# EAGLE design cd32 (EAGLE 7.7.0)
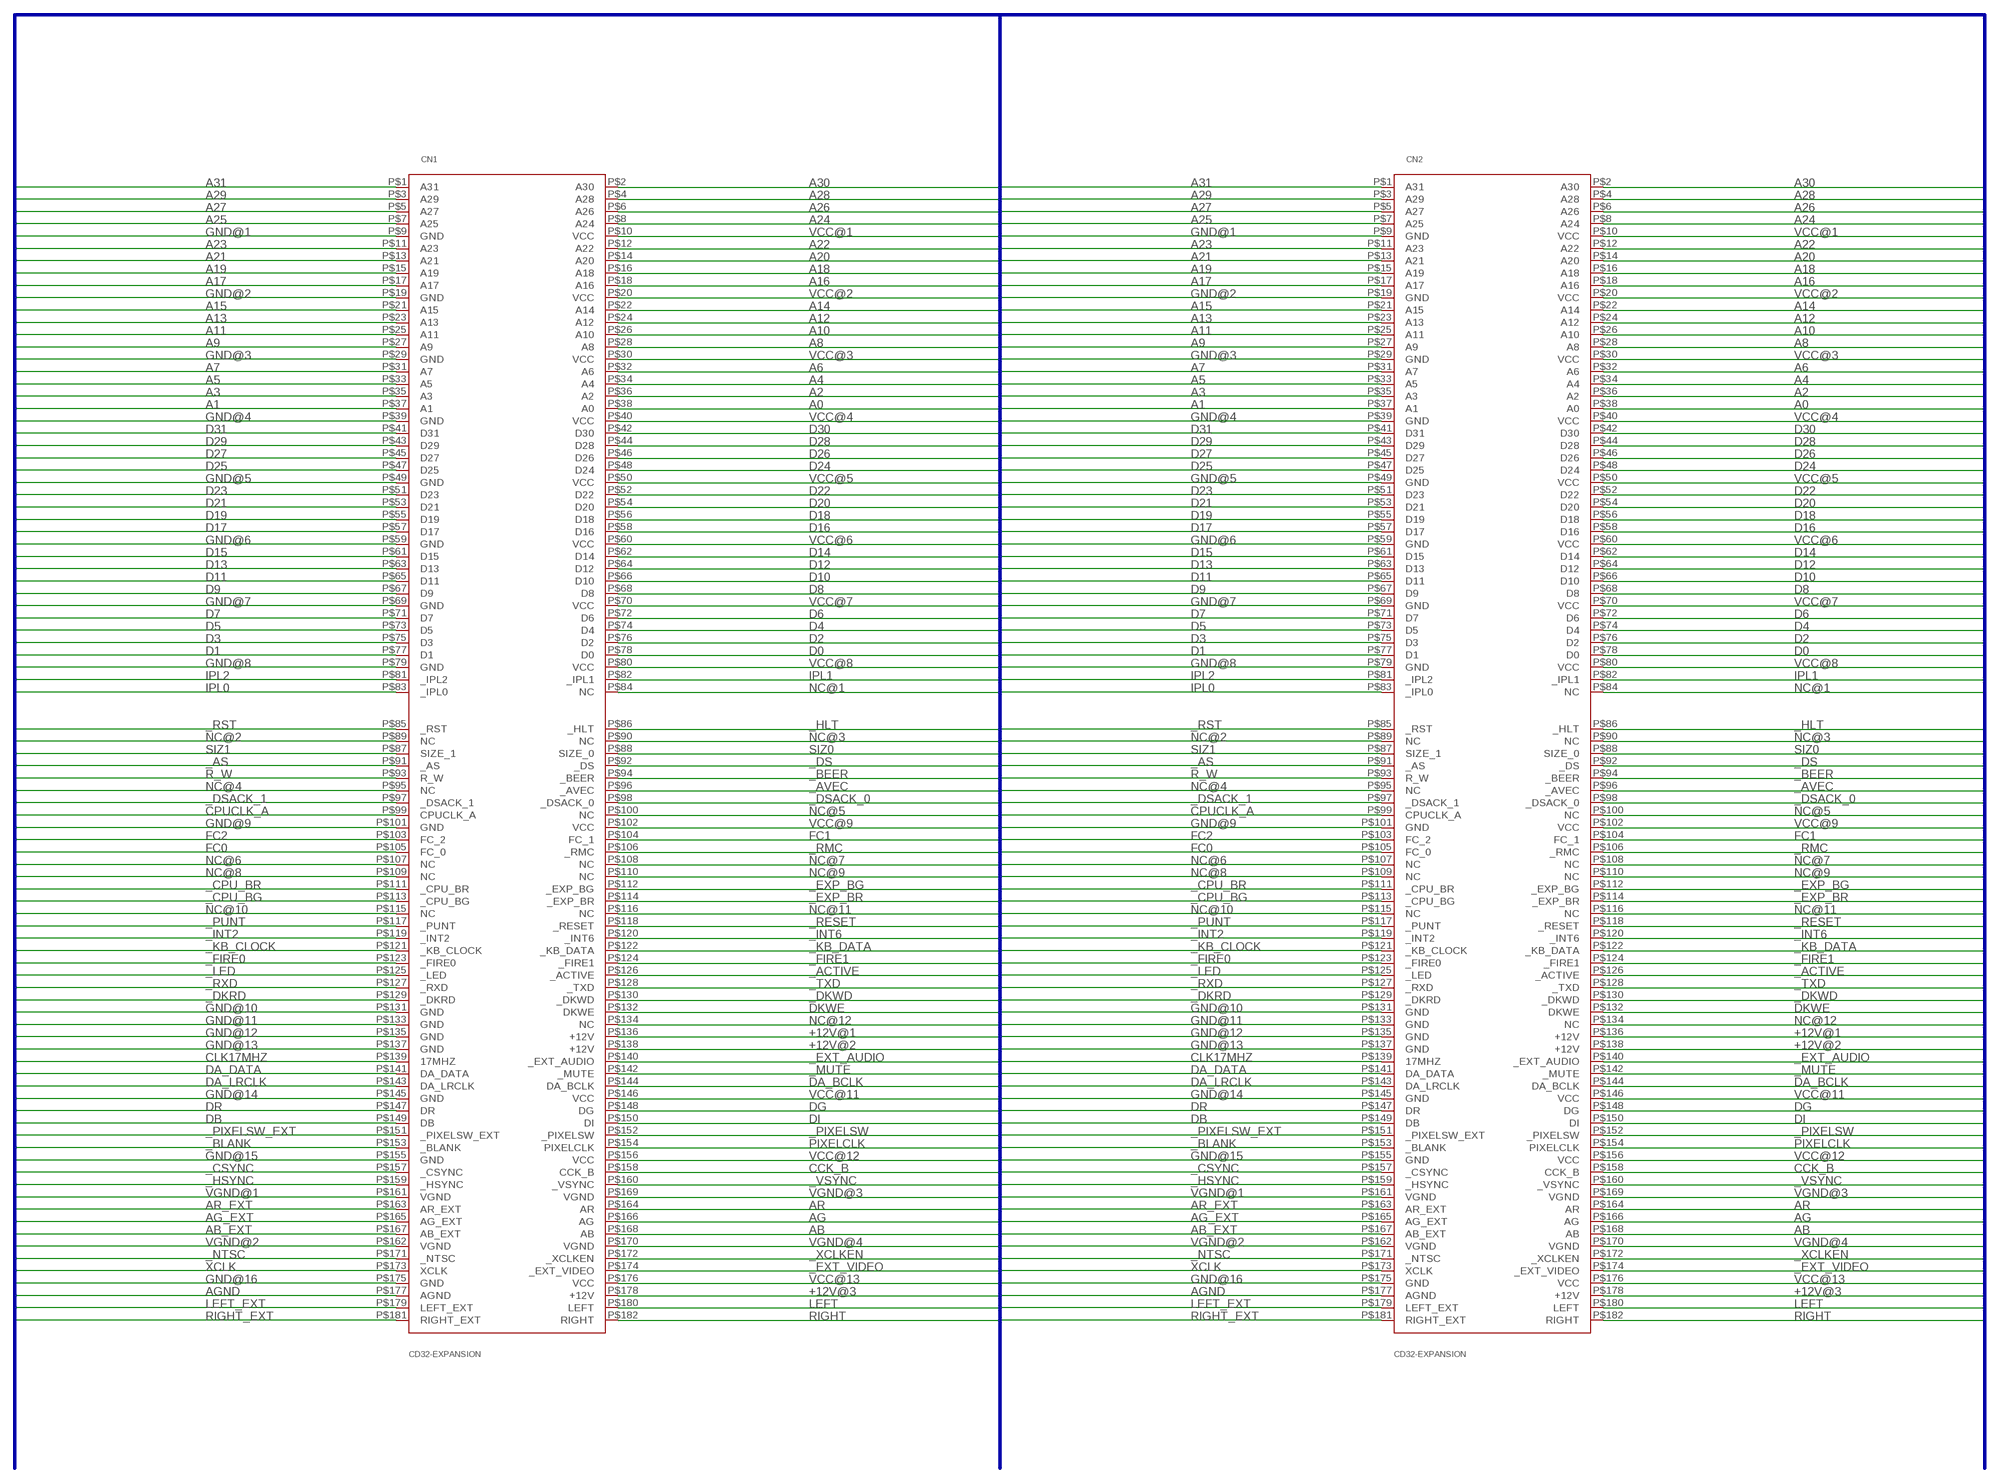
[diagram p0: schematic, sheet 1]

## Parts
CN1  CD32-EXPANSION  [CD32_EXPANSION_182_MCA]
CN2  CD32-EXPANSION  [CD32_EXPANSION_182_MCA]

## Nets
+12V@1: CN1.P$136(+12V) CN2.P$136(+12V)
+12V@2: CN1.P$138(+12V) CN2.P$138(+12V)
+12V@3: CN1.P$178(+12V) CN2.P$178(+12V)
_ACTIVE: CN1.P$126(_ACTIVE) CN2.P$126(_ACTIVE)
_AS: CN1.P$91(_AS) CN2.P$91(_AS)
_AVEC: CN1.P$96(_AVEC) CN2.P$96(_AVEC)
_BEER: CN1.P$94(_BEER) CN2.P$94(_BEER)
_BLANK: CN1.P$153(_BLANK) CN2.P$153(_BLANK)
_CPU_BG: CN1.P$113(_CPU_BG) CN2.P$113(_CPU_BG)
_CPU_BR: CN1.P$111(_CPU_BR) CN2.P$111(_CPU_BR)
_CSYNC: CN1.P$157(_CSYNC) CN2.P$157(_CSYNC)
_DKRD: CN1.P$129(_DKRD) CN2.P$129(_DKRD)
_DKWD: CN1.P$130(_DKWD) CN2.P$130(_DKWD)
_DS: CN1.P$92(_DS) CN2.P$92(_DS)
_DSACK_0: CN1.P$98(_DSACK_0) CN2.P$98(_DSACK_0)
_DSACK_1: CN1.P$97(_DSACK_1) CN2.P$97(_DSACK_1)
_EXP_BG: CN1.P$112(_EXP_BG) CN2.P$112(_EXP_BG)
_EXP_BR: CN1.P$114(_EXP_BR) CN2.P$114(_EXP_BR)
_EXT_AUDIO: CN1.P$140(_EXT_AUDIO) CN2.P$140(_EXT_AUDIO)
_EXT_VIDEO: CN1.P$174(_EXT_VIDEO) CN2.P$174(_EXT_VIDEO)
_FIRE0: CN1.P$123(_FIRE0) CN2.P$123(_FIRE0)
_FIRE1: CN1.P$124(_FIRE1) CN2.P$124(_FIRE1)
_HLT: CN1.P$86(_HLT) CN2.P$86(_HLT)
_HSYNC: CN1.P$159(_HSYNC) CN2.P$159(_HSYNC)
_INT2: CN1.P$119(_INT2) CN2.P$119(_INT2)
_INT6: CN1.P$120(_INT6) CN2.P$120(_INT6)
_KB_CLOCK: CN1.P$121(_KB_CLOCK) CN2.P$121(_KB_CLOCK)
_KB_DATA: CN1.P$122(_KB_DATA) CN2.P$122(_KB_DATA)
_LED: CN1.P$125(_LED) CN2.P$125(_LED)
_MUTE: CN1.P$142(_MUTE) CN2.P$142(_MUTE)
_NTSC: CN1.P$171(_NTSC) CN2.P$171(_NTSC)
_PIXELSW: CN1.P$152(_PIXELSW) CN2.P$152(_PIXELSW)
_PIXELSW_EXT: CN1.P$151(_PIXELSW_EXT) CN2.P$151(_PIXELSW_EXT)
_PUNT: CN1.P$117(_PUNT) CN2.P$117(_PUNT)
_RESET: CN1.P$118(_RESET) CN2.P$118(_RESET)
_RMC: CN1.P$106(_RMC) CN2.P$106(_RMC)
_RST: CN1.P$85(_RST) CN2.P$85(_RST)
_RXD: CN1.P$127(_RXD) CN2.P$127(_RXD)
_TXD: CN1.P$128(_TXD) CN2.P$128(_TXD)
_VSYNC: CN1.P$160(_VSYNC) CN2.P$160(_VSYNC)
_XCLKEN: CN1.P$172(_XCLKEN) CN2.P$172(_XCLKEN)
A0: CN1.P$38(A0) CN2.P$38(A0)
A1: CN1.P$37(A1) CN2.P$37(A1)
A2: CN1.P$36(A2) CN2.P$36(A2)
A3: CN1.P$35(A3) CN2.P$35(A3)
A4: CN1.P$34(A4) CN2.P$34(A4)
A5: CN1.P$33(A5) CN2.P$33(A5)
A6: CN1.P$32(A6) CN2.P$32(A6)
A7: CN1.P$31(A7) CN2.P$31(A7)
A8: CN1.P$28(A8) CN2.P$28(A8)
A9: CN1.P$27(A9) CN2.P$27(A9)
A10: CN1.P$26(A10) CN2.P$26(A10)
A11: CN1.P$25(A11) CN2.P$25(A11)
A12: CN1.P$24(A12) CN2.P$24(A12)
A13: CN1.P$23(A13) CN2.P$23(A13)
A14: CN1.P$22(A14) CN2.P$22(A14)
A15: CN1.P$21(A15) CN2.P$21(A15)
A16: CN1.P$18(A16) CN2.P$18(A16)
A17: CN1.P$17(A17) CN2.P$17(A17)
A18: CN1.P$16(A18) CN2.P$16(A18)
A19: CN1.P$15(A19) CN2.P$15(A19)
A20: CN1.P$14(A20) CN2.P$14(A20)
A21: CN1.P$13(A21) CN2.P$13(A21)
A22: CN1.P$12(A22) CN2.P$12(A22)
A23: CN1.P$11(A23) CN2.P$11(A23)
A24: CN1.P$8(A24) CN2.P$8(A24)
A25: CN1.P$7(A25) CN2.P$7(A25)
A26: CN1.P$6(A26) CN2.P$6(A26)
A27: CN1.P$5(A27) CN2.P$5(A27)
A28: CN1.P$4(A28) CN2.P$4(A28)
A29: CN1.P$3(A29) CN2.P$3(A29)
A30: CN1.P$2(A30) CN2.P$2(A30)
A31: CN1.P$1(A31) CN2.P$1(A31)
AB: CN1.P$168(AB) CN2.P$168(AB)
AB_EXT: CN1.P$167(AB_EXT) CN2.P$167(AB_EXT)
AG: CN1.P$166(AG) CN2.P$166(AG)
AG_EXT: CN1.P$165(AG_EXT) CN2.P$165(AG_EXT)
AGND: CN1.P$177(AGND) CN2.P$177(AGND)
AR: CN1.P$164(AR) CN2.P$164(AR)
AR_EXT: CN1.P$163(AR_EXT) CN2.P$163(AR_EXT)
CCK_B: CN1.P$158(CCK_B) CN2.P$158(CCK_B)
CLK17MHZ: CN1.P$139(17MHZ) CN2.P$139(17MHZ)
CPUCLK_A: CN1.P$99(CPUCLK_A) CN2.P$99(CPUCLK_A)
D0: CN1.P$78(D0) CN2.P$78(D0)
D1: CN1.P$77(D1) CN2.P$77(D1)
D2: CN1.P$76(D2) CN2.P$76(D2)
D3: CN1.P$75(D3) CN2.P$75(D3)
D4: CN1.P$74(D4) CN2.P$74(D4)
D5: CN1.P$73(D5) CN2.P$73(D5)
D6: CN1.P$72(D6) CN2.P$72(D6)
D7: CN1.P$71(D7) CN2.P$71(D7)
D8: CN1.P$68(D8) CN2.P$68(D8)
D9: CN1.P$67(D9) CN2.P$67(D9)
D10: CN1.P$66(D10) CN2.P$66(D10)
D11: CN1.P$65(D11) CN2.P$65(D11)
D12: CN1.P$64(D12) CN2.P$64(D12)
D13: CN1.P$63(D13) CN2.P$63(D13)
D14: CN1.P$62(D14) CN2.P$62(D14)
D15: CN1.P$61(D15) CN2.P$61(D15)
D16: CN1.P$58(D16) CN2.P$58(D16)
D17: CN1.P$57(D17) CN2.P$57(D17)
D18: CN1.P$56(D18) CN2.P$56(D18)
D19: CN1.P$55(D19) CN2.P$55(D19)
D20: CN1.P$54(D20) CN2.P$54(D20)
D21: CN1.P$53(D21) CN2.P$53(D21)
D22: CN1.P$52(D22) CN2.P$52(D22)
D23: CN1.P$51(D23) CN2.P$51(D23)
D24: CN1.P$48(D24) CN2.P$48(D24)
D25: CN1.P$47(D25) CN2.P$47(D25)
D26: CN1.P$46(D26) CN2.P$46(D26)
D27: CN1.P$45(D27) CN2.P$45(D27)
D28: CN1.P$44(D28) CN2.P$44(D28)
D29: CN1.P$43(D29) CN2.P$43(D29)
D30: CN1.P$42(D30) CN2.P$42(D30)
D31: CN1.P$41(D31) CN2.P$41(D31)
DA_BCLK: CN1.P$144(DA_BCLK) CN2.P$144(DA_BCLK)
DA_DATA: CN1.P$141(DA_DATA) CN2.P$141(DA_DATA)
DA_LRCLK: CN1.P$143(DA_LRCLK) CN2.P$143(DA_LRCLK)
DB: CN1.P$149(DB) CN2.P$149(DB)
DG: CN1.P$148(DG) CN2.P$148(DG)
DI: CN1.P$150(DI) CN2.P$150(DI)
DKWE: CN1.P$132(DKWE) CN2.P$132(DKWE)
DR: CN1.P$147(DR) CN2.P$147(DR)
FC0: CN1.P$105(FC_0) CN2.P$105(FC_0)
FC1: CN1.P$104(FC_1) CN2.P$104(FC_1)
FC2: CN1.P$103(FC_2) CN2.P$103(FC_2)
GND@1: CN1.P$9(GND) CN2.P$9(GND)
GND@2: CN1.P$19(GND) CN2.P$19(GND)
GND@3: CN1.P$29(GND) CN2.P$29(GND)
GND@4: CN1.P$39(GND) CN2.P$39(GND)
GND@5: CN1.P$49(GND) CN2.P$49(GND)
GND@6: CN1.P$59(GND) CN2.P$59(GND)
GND@7: CN1.P$69(GND) CN2.P$69(GND)
GND@8: CN1.P$79(GND) CN2.P$79(GND)
GND@9: CN1.P$101(GND) CN2.P$101(GND)
GND@10: CN1.P$131(GND) CN2.P$131(GND)
GND@11: CN1.P$133(GND) CN2.P$133(GND)
GND@12: CN1.P$135(GND) CN2.P$135(GND)
GND@13: CN1.P$137(GND) CN2.P$137(GND)
GND@14: CN1.P$145(GND) CN2.P$145(GND)
GND@15: CN1.P$155(GND) CN2.P$155(GND)
GND@16: CN1.P$175(GND) CN2.P$175(GND)
IPL0: CN1.P$83(_IPL0) CN2.P$83(_IPL0)
IPL1: CN1.P$82(_IPL1) CN2.P$82(_IPL1)
IPL2: CN1.P$81(_IPL2) CN2.P$81(_IPL2)
LEFT: CN1.P$180(LEFT) CN2.P$180(LEFT)
LEFT_EXT: CN1.P$179(LEFT_EXT) CN2.P$179(LEFT_EXT)
NC@1: CN1.P$84(NC) CN2.P$84(NC)
NC@2: CN1.P$89(NC) CN2.P$89(NC)
NC@3: CN1.P$90(NC) CN2.P$90(NC)
NC@4: CN1.P$95(NC) CN2.P$95(NC)
NC@5: CN1.P$100(NC) CN2.P$100(NC)
NC@6: CN1.P$107(NC) CN2.P$107(NC)
NC@7: CN1.P$108(NC) CN2.P$108(NC)
NC@8: CN1.P$109(NC) CN2.P$109(NC)
NC@9: CN1.P$110(NC) CN2.P$110(NC)
NC@10: CN1.P$115(NC) CN2.P$115(NC)
NC@11: CN1.P$116(NC) CN2.P$116(NC)
NC@12: CN1.P$134(NC) CN2.P$134(NC)
PIXELCLK: CN1.P$154(PIXELCLK) CN2.P$154(PIXELCLK)
R_W: CN1.P$93(R_W) CN2.P$93(R_W)
RIGHT: CN1.P$182(RIGHT) CN2.P$182(RIGHT)
RIGHT_EXT: CN1.P$181(RIGHT_EXT) CN2.P$181(RIGHT_EXT)
SIZ0: CN1.P$88(SIZE_0) CN2.P$88(SIZE_0)
SIZ1: CN1.P$87(SIZE_1) CN2.P$87(SIZE_1)
VCC@1: CN1.P$10(VCC) CN2.P$10(VCC)
VCC@2: CN1.P$20(VCC) CN2.P$20(VCC)
VCC@3: CN1.P$30(VCC) CN2.P$30(VCC)
VCC@4: CN1.P$40(VCC) CN2.P$40(VCC)
VCC@5: CN1.P$50(VCC) CN2.P$50(VCC)
VCC@6: CN1.P$60(VCC) CN2.P$60(VCC)
VCC@7: CN1.P$70(VCC) CN2.P$70(VCC)
VCC@8: CN1.P$80(VCC) CN2.P$80(VCC)
VCC@9: CN1.P$102(VCC) CN2.P$102(VCC)
VCC@11: CN1.P$146(VCC) CN2.P$146(VCC)
VCC@12: CN1.P$156(VCC) CN2.P$156(VCC)
VCC@13: CN1.P$176(VCC) CN2.P$176(VCC)
VGND@1: CN1.P$161(VGND) CN2.P$161(VGND)
VGND@2: CN1.P$162(VGND) CN2.P$162(VGND)
VGND@3: CN1.P$169(VGND) CN2.P$169(VGND)
VGND@4: CN1.P$170(VGND) CN2.P$170(VGND)
XCLK: CN1.P$173(XCLK) CN2.P$173(XCLK)

## Buses
A[0..31],AB,AB_EXT,_ACTIVE,AG,AG_EXT,AGND,AR,AR_EXT,_AS,_AVEC,_BEER,_BLANK,CCK_B,CLK_17MHZ,_CPU_BG,_CPU_BR,CPUCLK_A,_CSYNC,D[0..31],DA_BCLK,DA_DATA,DA_LRCLK,DB,DG,DI,_DKRD,_DKWD,DKWE,DR,_DS,_DSACK_0,_DSACK_1,_EXP_BG,_EXP_BR,_EXT_AUDIO,_EXT_VIDEO,FC[0..2],_FIRE0,_FIRE1,GND,_HLT,_HSYNC,_INT2,_INT6,_IPL[0..2],_KB_CLOCK,_KB_DATA,_LED,LEFT,LEFT_EXT,_MUTE,NC,_NTSC,PIXELCLK,_PIXELSW,_PIXELSW_EXT,_PUNT,_RESET,RIGHT,RIGHT_EXT,_RMC,_RST,R_W,_RXD,SIZE[0..1],_TXD,VCC,VCC12V,VGND,_VSYNC,XCLK,_XCLKEN

## Library data of the parts
CN1 CN2 = Amiga:CD32-EXPANSION

## Board
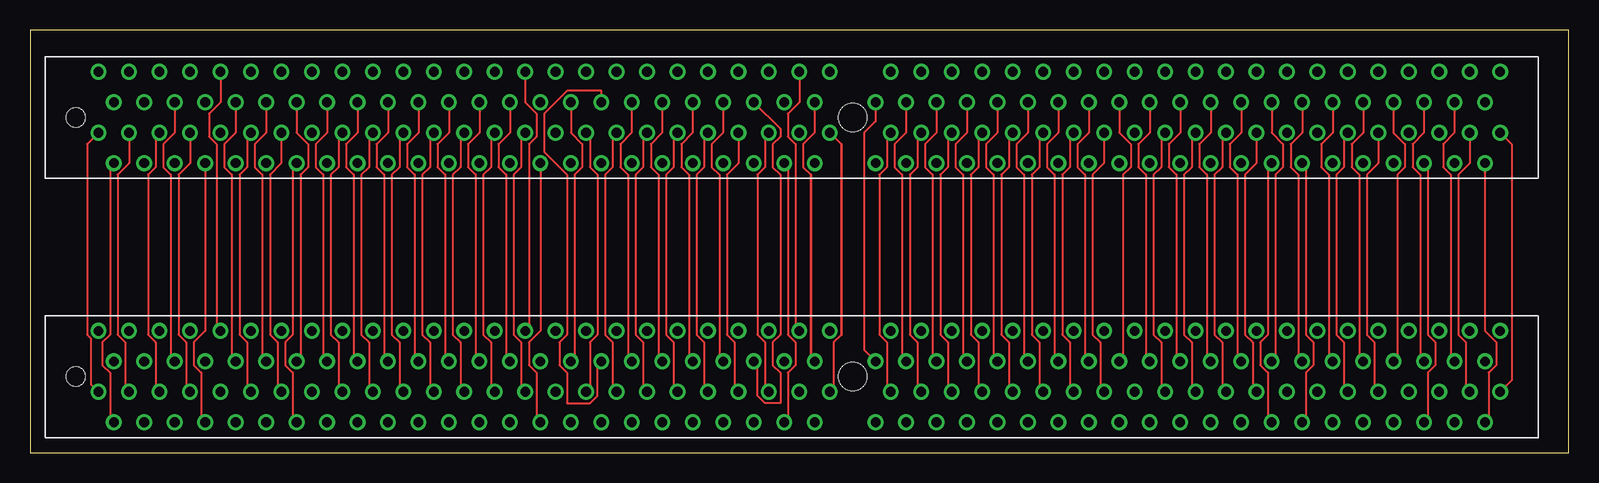
[diagram p1: board, top side]
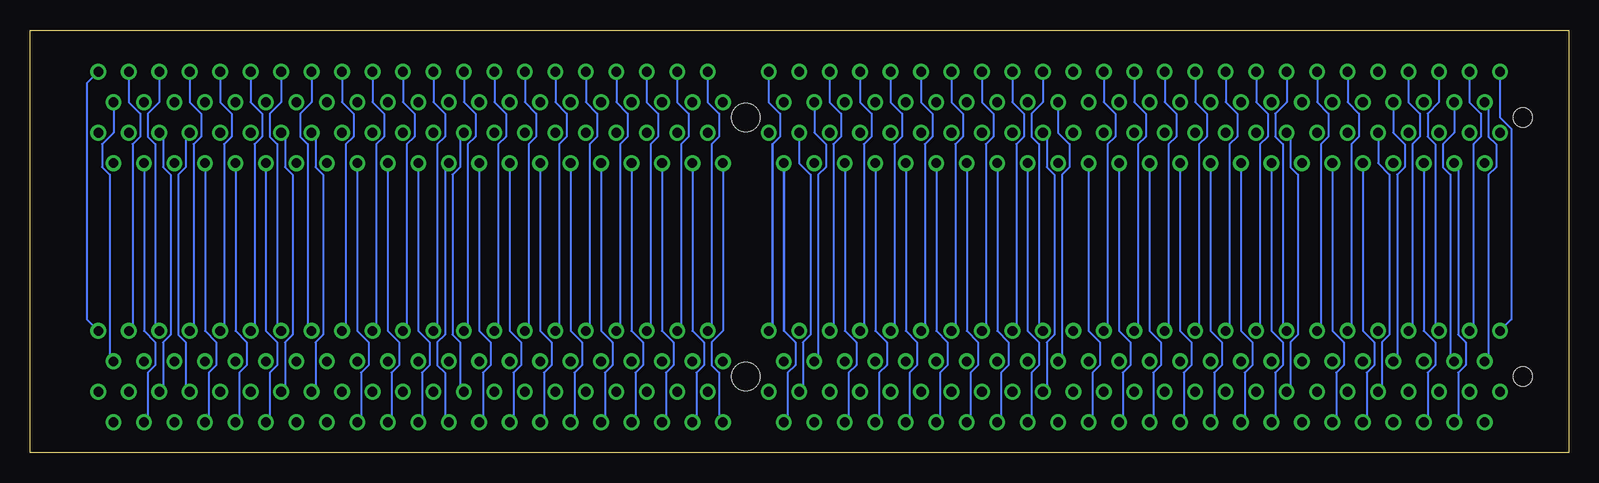
[diagram p2: board, bottom side, seen from below]

Size 128.25 x 35.23 mm. Coordinates in mm from the lower left corner, seen from the top.
Outline: 0,0 128.25,0 128.25,35.23 0,35.23 0,0
Copper layers (1*16): Top 0.035mm / dielectric 1.5mm / Bottom 0.035mm
Design rules "dirt_cheap_dirty_boards.v1 *": minimum track width 7mil, minimum drill 12mil, track to track 6mil, track to pad 6mil, pad to pad 6mil, via to via 6mil, smd to smd 0mil, copper to edge 10mil, drill to drill 10mil, minimum pad ring 10mil, minimum via ring 6mil, stop-mask expansion 2mil, vias tented up to drill 25mil, thermal gap 10mil

### Footprints (pad centres in the part's own frame; a part is rotated, then mirrored left to right if it is on the bottom)
CD32_EXPANSION_182_MCA = drill 0.8: P$1 59.055,-1.27; P$2 59.055,3.81; P$3 57.785,-3.81; P$4 57.785,1.27; P$5 56.515,-1.27; P$6 56.515,3.81; P$7 55.245,-3.81; P$8 55.245,1.27; P$9 53.975,-1.27; P$10 53.975,3.81; P$11 52.705,-3.81; P$12 52.705,1.27; P$13 51.435,-1.27; P$14 51.435,3.81; P$15 50.165,-3.81; P$16 50.165,1.27; P$17 48.895,-1.27; P$18 48.895,3.81; P$19 47.625,-3.81; P$20 47.625,1.27; P$21 46.355,-1.27; P$22 46.355,3.81; P$23 45.085,-3.81; P$24 45.085,1.27; P$25 43.815,-1.27; P$26 43.815,3.81; P$27 42.545,-3.81; P$28 42.545,1.27; P$29 41.275,-1.27; P$30 41.275,3.81; P$31 40.005,-3.81; P$32 40.005,1.27; P$33 38.735,-1.27; P$34 38.735,3.81; P$35 37.465,-3.81; P$36 37.465,1.27; P$37 36.195,-1.27; P$38 36.195,3.81; P$39 34.925,-3.81; P$40 34.925,1.27; P$41 33.655,-1.27; P$42 33.655,3.81; P$43 32.385,-3.81; P$44 32.385,1.27; P$45 31.115,-1.27; P$46 31.115,3.81; P$47 29.845,-3.81; P$48 29.845,1.27; P$49 28.575,-1.27; P$50 28.575,3.81; P$51 27.305,-3.81; P$52 27.305,1.27; P$53 26.035,-1.27; P$54 26.035,3.81; P$55 24.765,-3.81; P$56 24.765,1.27; P$57 23.495,-1.27; P$58 23.495,3.81; P$59 22.225,-3.81; P$60 22.225,1.27; P$61 20.955,-1.27; P$62 20.955,3.81; P$63 19.685,-3.81; P$64 19.685,1.27; P$65 18.415,-1.27; P$66 18.415,3.81; P$67 17.145,-3.81; P$68 17.145,1.27; P$69 15.875,-1.27; P$70 15.875,3.81; P$71 14.605,-3.81; P$72 14.605,1.27; P$73 13.335,-1.27; P$74 13.335,3.81; P$75 12.065,-3.81; P$76 12.065,1.27; P$77 10.795,-1.27; P$78 10.795,3.81; P$79 9.525,-3.81; P$80 9.525,1.27; P$81 8.255,-1.27; P$82 8.255,3.81; P$83 6.985,-3.81; P$84 6.985,1.27; P$85 3.175,-1.27; P$86 3.175,3.81; P$87 1.905,-3.81; P$88 1.905,1.27; P$89 0.635,-1.27; P$90 0.635,3.81; P$91 -0.635,-3.81; P$92 -0.635,1.27; P$93 -1.905,-1.27; P$94 -1.905,3.81; P$95 -3.175,-3.81; P$96 -3.175,1.27; P$97 -4.445,-1.27; P$98 -4.445,3.81; P$99 -5.715,-3.81; P$100 -5.715,1.27; P$101 -6.985,-1.27; P$102 -6.985,3.81; P$103 -8.255,-3.81; P$104 -8.255,1.27; P$105 -9.525,-1.27; P$106 -9.525,3.81; P$107 -10.795,-3.81; P$108 -10.795,1.27; P$109 -12.065,-1.27; P$110 -12.065,3.81; P$111 -13.335,-3.81; P$112 -13.335,1.27; P$113 -14.605,-1.27; P$114 -14.605,3.81; P$115 -15.875,-3.81; P$116 -15.875,1.27; P$117 -17.145,-1.27; P$118 -17.145,3.81; P$119 -18.415,-3.81; P$120 -18.415,1.27; P$121 -19.685,-1.27; P$122 -19.685,3.81; P$123 -20.955,-3.81; P$124 -20.955,1.27; P$125 -22.225,-1.27; P$126 -22.225,3.81; P$127 -23.495,-3.81; P$128 -23.495,1.27; P$129 -24.765,-1.27; P$130 -24.765,3.81; P$131 -26.035,-3.81; P$132 -26.035,1.27; P$133 -27.305,-1.27; P$134 -27.305,3.81; P$135 -28.575,-3.81; P$136 -28.575,1.27; P$137 -29.845,-1.27; P$138 -29.845,3.81; P$139 -31.115,-3.81; P$140 -31.115,1.27; P$141 -32.385,-1.27; P$142 -32.385,3.81; P$143 -33.655,-3.81; P$144 -33.655,1.27; P$145 -34.925,-1.27; P$146 -34.925,3.81; P$147 -36.195,-3.81; P$148 -36.195,1.27; P$149 -37.465,-1.27; P$150 -37.465,3.81; P$151 -38.735,-3.81; P$152 -38.735,1.27; P$153 -40.005,-1.27; P$154 -40.005,3.81; P$155 -41.275,-3.81; P$156 -41.275,1.27; P$157 -42.545,-1.27; P$158 -42.545,3.81; P$159 -43.815,-3.81; P$160 -43.815,1.27; P$161 -45.085,-1.27; P$162 -45.085,3.81; P$163 -46.355,-3.81; P$164 -46.355,1.27; P$165 -47.625,-1.27; P$166 -47.625,3.81; P$167 -48.895,-3.81; P$168 -48.895,1.27; P$169 -50.165,-1.27; P$170 -50.165,3.81; P$171 -51.435,-3.81; P$172 -51.435,1.27; P$173 -52.705,-1.27; P$174 -52.705,3.81; P$175 -53.975,-3.81; P$176 -53.975,1.27; P$177 -55.245,-1.27; P$178 -55.245,3.81; P$179 -56.515,-3.81; P$180 -56.515,1.27; P$181 -57.785,-1.27; P$182 -57.785,3.81 | hole 2.362: 5.08,0 | hole 1.6: -59.69,0

### Placement (x,y rotation side)
CN1  63.5,6.35 0 top
CN2  63.5,27.94 0 top

### Tracks (layer width: path | path; a pad name or v marks a point on that pad's centre or on a via)
+12V@1
  Top 0.178: CN1.P$136 34.61,7.94 34.61,23.18 33.97,23.81 33.97,25.72 34.92,26.67 CN2.P$136
+12V@2
  Bottom 0.178: CN1.P$138 33.34,10.48 33.34,25.72 32.7,26.35 32.7,28.26 33.66,29.21 CN2.P$138
+12V@3
  Bottom 0.178: CN1.P$178 7.94,10.48 7.94,25.72 7.3,26.35 7.3,28.26 8.26,29.21 CN2.P$178
_ACTIVE
  Top 0.178: CN1.P$126 41.59,10.48 41.59,25.72 42.23,26.35 42.23,28.26 41.27,29.21 CN2.P$126
_AS
  Top 0.178: CN1.P$91 63.18,2.86 63.18,6.67 63.82,7.3 63.82,9.21 63.18,9.84 63.18,23.81 CN2.P$91
_AVEC
  Top 0.178: CN1.P$96 60.64,7.3 60.64,4.76 61.28,4.13 62.55,4.13 62.55,6.67 61.91,7.3 61.91,9.21 62.55,9.84 62.55,23.18 61.91,23.81 61.91,25.72 62.55,26.35 62.55,26.99 CN2.P$96
_BEER
  Bottom 0.178: CN1.P$94 61.28,10.48 61.28,25.72 60.64,26.35 60.64,28.26 61.59,29.21 CN2.P$94
_BLANK
  Bottom 0.178: CN1.P$153 23.18,5.4 23.18,9.21 22.54,9.84 22.54,23.18 23.18,23.81 23.18,26.35 CN2.P$153
_CPU_BG
  Top 0.178: CN1.P$113 48.58,5.4 48.58,9.21 47.94,9.84 47.94,23.18 48.58,23.81 48.58,26.35 CN2.P$113
_CPU_BR
  Bottom 0.178: CN1.P$111 49.85,2.86 49.85,6.67 49.21,7.3 49.21,9.21 50.16,10.16 CN2.P$111
_CSYNC
  Top 0.178: CN1.P$157 20.64,5.4 20.64,9.21 20,9.84 20,23.18 20.95,24.13 CN2.P$157
_DKRD
  Top 0.178: CN1.P$129 38.42,5.4 38.42,9.21 37.78,9.84 37.78,23.18 38.42,23.81 38.42,26.35 CN2.P$129
_DKWD
  Bottom 0.178: CN1.P$130 38.42,10.48 38.42,25.72 37.78,26.35 37.78,28.26 38.73,29.21 CN2.P$130
_DS
  Bottom 0.178: CN1.P$92 62.55,7.94 62.55,23.18 61.91,23.81 61.91,25.72 62.87,26.67 CN2.P$92
_DSACK_0
  Bottom 0.178: CN1.P$98 58.74,10.48 58.74,25.72 58.1,26.35 58.1,28.26 59.05,29.21 CN2.P$98
_DSACK_1
  Top 0.178: CN1.P$97 58.74,5.4 58.74,9.21 58.1,9.84 58.1,23.18 59.05,24.13 CN2.P$97
_EXP_BG
  Top 0.178: CN1.P$112 49.85,7.94 49.85,23.18 49.21,23.81 49.21,25.72 50.16,26.67 CN2.P$112
_EXP_BR
  Bottom 0.178: CN1.P$114 48.58,10.48 48.58,25.72 47.94,26.35 47.94,28.26 48.9,29.21 CN2.P$114
_EXT_AUDIO
  Top 0.178: CN1.P$140 32.07,7.94 32.07,23.18 31.43,23.81 31.43,25.72 32.38,26.67 CN2.P$140
_EXT_VIDEO
  Bottom 0.178: CN1.P$174 11.11,10.48 11.11,25.72 11.75,26.35 11.75,28.26 10.79,29.21 CN2.P$174
_FIRE0
  Top 0.178: CN1.P$123 42.23,2.86 42.23,6.67 41.59,7.3 41.59,9.21 42.55,10.16 CN2.P$123
_FIRE1
  Bottom 0.178: CN1.P$124 42.23,7.94 42.23,23.18 41.59,23.81 41.59,25.72 42.55,26.67 CN2.P$124
_HLT
  Bottom 0.178: 66.36,10.48 CN1.P$86 | 66.36,25.72 65.72,26.35 65.72,28.26 66.67,29.21 CN2.P$86
  Bottom 0.203: 66.36,25.72 66.36,10.48
_HSYNC
  Bottom 0.178: CN1.P$159 19.37,2.86 19.37,6.67 18.73,7.3 18.73,9.21 19.68,10.16 CN2.P$159
_INT2
  Bottom 0.178: CN1.P$119 44.77,2.86 44.77,6.67 44.13,7.3 44.13,9.21 45.09,10.16 CN2.P$119
_INT6
  Top 0.178: CN1.P$120 45.4,7.94 45.4,23.18 46.04,23.81 46.04,25.72 45.09,26.67 CN2.P$120
_KB_CLOCK
  Bottom 0.178: CN1.P$121 43.5,5.4 43.5,9.21 42.86,9.84 42.86,23.18 43.5,23.81 43.5,26.35 CN2.P$121
_KB_DATA
  Bottom 0.178: CN1.P$122 44.13,10.48 44.13,25.72 44.77,26.35 44.77,28.26 43.81,29.21 CN2.P$122
_LED
  Top 0.178: CN1.P$125 40.96,5.4 40.96,9.21 40.32,9.84 40.32,23.18 40.96,23.81 40.96,26.35 CN2.P$125
_MUTE
  Bottom 0.178: CN1.P$142 30.8,10.48 30.8,25.72 30.16,26.35 30.16,28.26 31.11,29.21 CN2.P$142
_NTSC
  Bottom 0.178: CN1.P$171 11.75,2.86 11.75,6.67 11.11,7.3 11.11,9.21 12.06,10.16 CN2.P$171
_PIXELSW
  Top 0.178: CN1.P$152 24.45,7.94 24.45,23.18 23.81,23.81 23.81,25.72 24.77,26.67 CN2.P$152
_PIXELSW_EXT
  Bottom 0.178: CN1.P$151 24.45,2.86 24.45,6.67 23.81,7.3 23.81,9.21 24.77,10.16 CN2.P$151
_PUNT
  Top 0.178: CN1.P$117 46.67,5.4 46.67,9.21 47.31,9.84 47.31,23.18 46.67,23.81 46.67,26.35 CN2.P$117
_RESET
  Bottom 0.178: CN1.P$118 46.04,10.48 46.04,25.72 45.4,26.35 45.4,28.26 46.35,29.21 CN2.P$118
_RMC
  Bottom 0.178: CN1.P$106 53.66,10.48 53.66,25.72 53.02,26.35 53.02,28.26 53.98,29.21 CN2.P$106
_RST
  Top 0.178: CN1.P$85 66.99,5.4 66.99,9.21 67.63,9.84 | CN2.P$85 67.63,25.72
  Top 0.203: 67.63,25.72 67.63,9.84
_RXD
  Bottom 0.178: CN1.P$127 39.69,2.86 39.69,6.67 39.05,7.3 39.05,9.21 40.01,10.16 CN2.P$127
_TXD
  Top 0.178: CN1.P$128 39.69,7.94 39.69,23.18 39.05,23.81 39.05,25.72 40.01,26.67 CN2.P$128
_VSYNC
  Top 0.178: CN1.P$160 19.37,7.94 19.37,23.18 18.73,23.81 18.73,25.72 19.68,26.67 CN2.P$160
_XCLKEN
  Top 0.178: CN1.P$172 11.75,7.94 11.75,23.18 11.11,23.81 11.11,25.72 12.06,26.67 CN2.P$172
A0
  Bottom 0.178: CN1.P$38 99.38,10.48 99.38,25.72 98.74,26.35 98.74,28.26 99.69,29.21 CN2.P$38
A1
  Top 0.178: CN1.P$37 99.38,5.4 99.38,9.21 98.74,9.84 98.74,23.18 99.38,23.81 99.38,26.35 CN2.P$37
A2
  Top 0.178: CN1.P$36 100.65,7.94 100.65,23.18 100.01,23.81 100.01,25.72 100.97,26.67 CN2.P$36
A3
  Bottom 0.178: CN1.P$35 100.65,2.86 100.65,6.67 100.01,7.3 100.01,9.21 100.97,10.16 CN2.P$35
A4
  Bottom 0.178: CN1.P$34 101.92,10.48 101.92,25.72 101.28,26.35 101.28,28.26 102.23,29.21 CN2.P$34
A5
  Top 0.178: CN1.P$33 101.92,5.4 101.92,9.21 101.28,9.84 101.28,23.18 102.23,24.13 CN2.P$33
A6
  Top 0.178: CN1.P$32 103.82,7.94 103.82,23.18 104.46,23.81 104.46,25.72 103.5,26.67 CN2.P$32
A7
  Top 0.178: CN1.P$31 103.19,2.86 103.19,6.67 102.55,7.3 102.55,9.21 103.19,9.84 103.19,23.81 CN2.P$31
A8
  Top 0.178: CN1.P$28 105.73,7.94 105.73,23.18 105.09,23.81 105.09,25.72 106.05,26.67 CN2.P$28
A9
  Top 0.178: CN1.P$27 106.36,2.86 106.36,6.67 107,7.3 107,9.21 106.36,9.84 106.36,23.81 CN2.P$27
A10
  Bottom 0.178: CN1.P$26 107.63,10.48 107.63,25.72 108.27,26.35 108.27,28.26 107.31,29.21 CN2.P$26
A11
  Bottom 0.178: CN1.P$25 107,5.4 107,9.21 106.36,9.84 106.36,23.18 107,23.81 107,26.35 CN2.P$25
A12
  Top 0.178: CN1.P$24 108.27,7.94 108.27,23.18 107.63,23.81 107.63,25.72 108.58,26.67 CN2.P$24
A13
  Bottom 0.178: CN1.P$23 108.27,2.86 108.27,6.67 107.63,7.3 107.63,9.21 108.58,10.16 CN2.P$23
A14
  Bottom 0.178: CN1.P$22 109.54,10.48 109.54,25.72 108.9,26.35 108.9,28.26 109.86,29.21 CN2.P$22
A15
  Top 0.178: CN1.P$21 109.54,5.4 109.54,9.21 108.9,9.84 108.9,23.18 109.54,23.81 109.54,26.35 CN2.P$21
A16
  Bottom 0.178: CN1.P$18 112.08,10.48 112.08,25.72 111.44,26.35 111.44,28.26 112.39,29.21 CN2.P$18
A17
  Top 0.178: CN1.P$17 112.08,5.4 112.08,9.21 111.44,9.84 111.44,23.18 112.39,24.13 CN2.P$17
A18
  Top 0.178: CN1.P$16 113.98,7.94 113.98,23.18 114.62,23.81 114.62,25.72 113.67,26.67 CN2.P$16
A19
  Bottom 0.178: CN1.P$15 113.35,2.86 113.35,6.67 112.71,7.3 112.71,9.21 113.67,10.16 CN2.P$15
A20
  Bottom 0.178: CN1.P$14 114.62,10.48 114.62,25.72 113.98,26.35 113.98,28.26 114.94,29.21 CN2.P$14
A21
  Bottom 0.178: CN1.P$13 115.25,5.4 115.25,9.21 115.89,9.84 115.89,23.18 115.25,23.81 115.25,26.35 CN2.P$13
A22
  Top 0.178: CN1.P$12 115.89,7.94 115.89,23.18 115.25,23.81 115.25,25.72 116.2,26.67 CN2.P$12
A23
  Top 0.178: CN1.P$11 116.52,2.86 116.52,6.67 117.16,7.3 117.16,9.21 116.52,9.84 116.52,23.81 CN2.P$11
A24
  Top 0.178: CN1.P$8 118.43,7.94 118.43,23.18 117.79,23.81 117.79,25.72 118.75,26.67 CN2.P$8
A25
  Bottom 0.178: CN1.P$7 118.43,2.86 118.43,6.67 117.79,7.3 117.79,9.21 118.75,10.16 CN2.P$7
A26
  Bottom 0.178: CN1.P$6 119.7,10.48 119.7,25.72 119.06,26.35 119.06,28.26 120.02,29.21 CN2.P$6
A27
  Top 0.178: CN1.P$5 119.7,5.4 119.7,9.21 119.06,9.84 119.06,23.18 120.02,24.13 CN2.P$5
A28
  Bottom 0.178: CN1.P$4 121.6,7.94 121.6,23.18 122.24,23.81 122.24,25.72 121.28,26.67 CN2.P$4
A29
  Top 0.178: CN1.P$3 121.6,2.86 121.6,6.67 122.24,7.3 122.24,9.21 121.28,10.16 CN2.P$3
A30
  Bottom 0.178: CN1.P$2 123.51,11.11 123.51,30.8 CN2.P$2
A31
  Top 0.178: CN1.P$1 123.51,6.03 123.51,25.72 CN2.P$1
AB
  Bottom 0.178: CN1.P$168 14.29,7.94 14.29,23.18 13.65,23.81 13.65,25.72 14.61,26.67 CN2.P$168
AB_EXT
  Top 0.178: CN1.P$167 14.29,2.86 14.29,6.67 13.65,7.3 13.65,9.21 14.61,10.16 CN2.P$167
AG
  Top 0.178: CN1.P$166 15.56,10.48 15.56,25.72 14.92,26.35 14.92,28.26 15.88,29.21 CN2.P$166
AG_EXT
  Bottom 0.178: CN1.P$165 15.56,5.4 15.56,9.21 14.92,9.84 14.92,23.18 15.88,24.13 CN2.P$165
AGND
  Top 0.178: CN1.P$177 7.94,5.4 7.94,9.21 7.3,9.84 7.3,23.18 8.26,24.13 CN2.P$177
AR
  Top 0.178: CN1.P$164 16.83,7.94 16.83,23.18 16.19,23.81 16.19,25.72 17.14,26.67 CN2.P$164
AR_EXT
  Bottom 0.178: CN1.P$163 16.83,2.86 16.83,6.67 16.19,7.3 16.19,9.21 17.14,10.16 CN2.P$163
CCK_B
  Bottom 0.178: CN1.P$158 20.64,10.48 20.64,25.72 20,26.35 20,28.26 20.95,29.21 CN2.P$158
CLK17MHZ
  Bottom 0.178: CN1.P$139 32.07,2.86 32.07,6.67 31.43,7.3 31.43,9.21 32.38,10.16 CN2.P$139
CPUCLK_A
  Bottom 0.178: CN1.P$99 57.47,2.86 57.47,6.67 56.83,7.3 56.83,9.21 57.78,10.16 CN2.P$99
D0
  Bottom 0.178: CN1.P$78 73.98,10.48 73.98,25.72 73.34,26.35 73.34,28.26 74.3,29.21 CN2.P$78
D1
  Top 0.178: CN1.P$77 73.98,5.4 73.98,9.21 73.34,9.84 73.34,23.18 73.98,23.81 73.98,26.35 CN2.P$77
D2
  Top 0.178: CN1.P$76 75.25,7.94 75.25,23.18 74.61,23.81 74.61,25.72 75.56,26.67 CN2.P$76
D3
  Bottom 0.178: CN1.P$75 75.25,2.86 75.25,6.67 74.61,7.3 74.61,9.21 75.56,10.16 CN2.P$75
D4
  Bottom 0.178: CN1.P$74 76.52,10.48 76.52,25.72 75.88,26.35 75.88,28.26 76.83,29.21 CN2.P$74
D5
  Top 0.178: CN1.P$73 76.52,5.4 76.52,9.21 75.88,9.84 75.88,23.18 76.52,23.81 76.52,26.35 CN2.P$73
D6
  Top 0.178: CN1.P$72 77.79,7.94 77.79,23.18 77.15,23.81 77.15,25.72 78.11,26.67 CN2.P$72
D7
  Bottom 0.178: CN1.P$71 77.79,2.86 77.79,6.67 77.15,7.3 77.15,9.21 78.11,10.16 CN2.P$71
D8
  Top 0.178: CN1.P$68 80.33,7.94 80.33,23.18 79.69,23.81 79.69,25.72 80.64,26.67 CN2.P$68
D9
  Bottom 0.178: CN1.P$67 80.33,2.86 80.33,6.67 79.69,7.3 79.69,9.21 80.64,10.16 CN2.P$67
D10
  Bottom 0.178: CN1.P$66 81.6,10.48 81.6,25.72 80.96,26.35 80.96,28.26 81.92,29.21 CN2.P$66
D11
  Top 0.178: CN1.P$65 81.6,5.4 81.6,9.21 80.96,9.84 80.96,23.18 81.6,23.81 81.6,26.35 CN2.P$65
D12
  Top 0.178: CN1.P$64 82.87,7.94 82.87,23.18 82.23,23.81 82.23,25.72 83.19,26.67 CN2.P$64
D13
  Bottom 0.178: CN1.P$63 82.87,2.86 82.87,6.67 82.23,7.3 82.23,9.21 83.19,10.16 CN2.P$63
D14
  Bottom 0.178: CN1.P$62 84.14,10.48 84.14,25.72 83.5,26.35 83.5,28.26 84.45,29.21 CN2.P$62
D15
  Top 0.178: CN1.P$61 84.14,5.4 84.14,9.21 83.5,9.84 83.5,23.18 84.14,23.81 84.14,26.35 CN2.P$61
D16
  Bottom 0.178: CN1.P$58 86.68,10.48 86.68,25.72 86.04,26.35 86.04,28.26 87,29.21 CN2.P$58
D17
  Top 0.178: CN1.P$57 86.68,5.4 86.68,9.21 86.04,9.84 86.04,23.18 86.68,23.81 86.68,26.35 CN2.P$57
D18
  Top 0.178: CN1.P$56 87.95,7.94 87.95,23.18 87.31,23.81 87.31,25.72 88.27,26.67 CN2.P$56
D19
  Bottom 0.178: CN1.P$55 87.95,2.86 87.95,6.67 87.31,7.3 87.31,9.21 88.27,10.16 CN2.P$55
D20
  Bottom 0.178: CN1.P$54 89.22,10.48 89.22,25.72 88.58,26.35 88.58,28.26 89.53,29.21 CN2.P$54
D21
  Top 0.178: CN1.P$53 89.22,5.4 89.22,9.21 88.58,9.84 88.58,23.18 89.53,24.13 CN2.P$53
D22
  Top 0.178: CN1.P$52 91.12,7.94 91.12,23.18 91.76,23.81 91.76,25.72 90.81,26.67 CN2.P$52
D23
  Bottom 0.178: CN1.P$51 90.49,2.86 90.49,6.67 89.85,7.3 89.85,9.21 90.81,10.16 CN2.P$51
D24
  Top 0.178: CN1.P$48 93.03,7.94 93.03,23.18 92.39,23.81 92.39,25.72 93.34,26.67 CN2.P$48
D25
  Bottom 0.178: CN1.P$47 93.66,2.86 93.66,6.67 94.3,7.3 94.3,9.21 93.66,9.84 93.66,23.81 CN2.P$47
D26
  Bottom 0.178: CN1.P$46 94.3,10.48 94.3,25.72 93.66,26.35 93.66,28.26 94.61,29.21 CN2.P$46
D27
  Top 0.178: CN1.P$45 94.3,5.4 94.3,9.21 93.66,9.84 93.66,23.18 94.3,23.81 94.3,26.35 CN2.P$45
D28
  Top 0.178: CN1.P$44 95.57,7.94 95.57,23.18 94.93,23.81 94.93,25.72 95.89,26.67 CN2.P$44
D29
  Bottom 0.178: CN1.P$43 95.57,2.86 95.57,6.67 94.93,7.3 94.93,9.21 95.89,10.16 CN2.P$43
D30
  Bottom 0.178: CN1.P$42 96.84,10.48 96.84,25.72 96.2,26.35 96.2,28.26 97.16,29.21 CN2.P$42
D31
  Top 0.178: CN1.P$41 96.84,5.4 96.84,9.21 96.2,9.84 96.2,23.18 96.84,23.81 96.84,26.35 CN2.P$41
DA_BCLK
  Top 0.178: CN1.P$144 29.53,7.94 29.53,23.18 28.89,23.81 28.89,25.72 29.84,26.67 CN2.P$144
DA_DATA
  Top 0.178: CN1.P$141 30.8,5.4 30.8,9.21 30.16,9.84 30.16,23.18 30.8,23.81 30.8,26.35 CN2.P$141
DA_LRCLK
  Bottom 0.178: CN1.P$143 29.53,2.86 29.53,6.67 28.89,7.3 28.89,9.21 29.84,10.16 CN2.P$143
DB
  Top 0.178: CN1.P$149 25.72,5.4 25.72,9.21 25.08,9.84 25.08,23.18 25.72,23.81 25.72,26.35 CN2.P$149
DG
  Top 0.178: CN1.P$148 26.99,7.94 26.99,23.18 26.35,23.81 26.35,25.72 27.3,26.67 CN2.P$148
DI
  Bottom 0.178: CN1.P$150 25.72,10.48 25.72,25.72 25.08,26.35 25.08,28.26 26.04,29.21 CN2.P$150
DKWE
  Top 0.178: CN1.P$132 37.15,7.94 37.15,23.18 36.51,23.81 36.51,25.72 37.47,26.67 CN2.P$132
DR
  Bottom 0.178: CN1.P$147 26.99,2.86 26.99,6.67 26.35,7.3 26.35,9.21 27.3,10.16 CN2.P$147
FC0
  Top 0.178: CN1.P$105 53.66,5.4 53.66,9.21 53.02,9.84 53.02,23.18 53.66,23.81 53.66,26.35 CN2.P$105
FC1
  Top 0.178: CN1.P$104 54.93,7.94 54.93,23.18 54.29,23.81 54.29,25.72 55.24,26.67 CN2.P$104
FC2
  Bottom 0.178: CN1.P$103 54.93,2.86 54.93,6.67 54.29,7.3 54.29,9.21 55.24,10.16 CN2.P$103
GND@1
  Bottom 0.178: CN1.P$9 117.16,5.4 117.16,9.21 116.52,9.84 116.52,23.18 117.16,23.81 117.16,26.35 CN2.P$9
GND@2
  Bottom 0.178: CN1.P$19 110.81,2.86 110.81,6.67 110.17,7.3 110.17,9.21 111.12,10.16 CN2.P$19
GND@3
  Bottom 0.178: CN1.P$29 104.46,5.4 104.46,9.21 103.82,9.84 103.82,23.18 104.46,23.81 104.46,26.35 CN2.P$29
GND@4
  Bottom 0.178: CN1.P$39 98.11,2.86 98.11,6.67 97.47,7.3 97.47,9.21 98.42,10.16 CN2.P$39
GND@5
  Bottom 0.178: CN1.P$49 92.39,5.4 92.39,9.21 93.03,9.84 93.03,23.18 92.39,23.81 92.39,26.35 CN2.P$49
GND@6
  Bottom 0.178: CN1.P$59 85.41,2.86 85.41,6.67 84.77,7.3 84.77,9.21 85.72,10.16 CN2.P$59
GND@7
  Top 0.178: CN1.P$69 79.06,5.4 79.06,9.21 78.42,9.84 78.42,23.18 79.06,23.81 79.06,26.35 CN2.P$69
GND@8
  Bottom 0.178: CN1.P$79 72.71,2.86 72.71,6.67 72.07,7.3 72.07,9.21 73.03,10.16 CN2.P$79
GND@9
  Top 0.178: CN1.P$101 56.2,5.4 56.2,9.21 55.56,9.84 55.56,23.18 56.2,23.81 56.2,26.35 CN2.P$101
GND@10
  Bottom 0.178: CN1.P$131 37.15,2.86 37.15,6.67 36.51,7.3 36.51,9.21 37.47,10.16 CN2.P$131
GND@11
  Top 0.178: CN1.P$133 35.88,5.4 35.88,9.21 35.24,9.84 35.24,23.18 35.88,23.81 35.88,26.35 CN2.P$133
GND@12
  Bottom 0.178: CN1.P$135 34.61,2.86 34.61,6.67 33.97,7.3 33.97,9.21 34.92,10.16 CN2.P$135
GND@13
  Top 0.178: CN1.P$137 33.34,5.4 33.34,9.21 32.7,9.84 32.7,23.18 33.34,23.81 33.34,26.35 CN2.P$137
GND@14
  Top 0.178: CN1.P$145 28.26,5.4 28.26,9.21 27.62,9.84 27.62,23.18 28.26,23.81 28.26,26.35 CN2.P$145
GND@15
  Top 0.178: CN1.P$155 21.91,2.86 21.91,6.67 21.27,7.3 21.27,9.21 21.91,9.84 21.91,23.81 CN2.P$155
GND@16
  Bottom 0.178: CN1.P$175 9.21,2.86 9.21,6.67 8.57,7.3 8.57,9.21 9.21,9.84 9.21,23.81 CN2.P$175
IPL0
  Bottom 0.178: CN1.P$83 70.8,2.86 70.8,6.67 71.44,7.3 71.44,9.21 70.48,10.16 CN2.P$83
IPL1
  Bottom 0.178: CN1.P$82 71.44,10.48 71.44,25.72 70.8,26.35 70.8,28.26 71.75,29.21 CN2.P$82
IPL2
  Top 0.178: CN1.P$81 71.44,5.4 71.44,9.21 70.8,9.84 70.8,23.18 71.44,23.81 71.44,26.35 CN2.P$81
LEFT
  Bottom 0.178: CN1.P$180 6.67,7.94 6.67,23.18 6.03,23.81 6.03,25.72 6.67,26.35 6.67,28.89 CN2.P$180
LEFT_EXT
  Top 0.178: CN1.P$179 6.67,2.86 6.67,6.67 6.03,7.3 6.03,9.21 6.67,9.84 6.67,23.81 CN2.P$179
NC@1
  Top 0.178: CN1.P$84 69.53,8.57 69.53,26.67 70.48,27.62 CN2.P$84
NC@2
  Bottom 0.178: CN1.P$89 63.82,5.4 63.82,9.21 63.18,9.84 63.18,23.18 64.14,24.13 CN2.P$89
NC@3
  Top 0.178: CN1.P$90 63.82,10.48 63.82,25.72 63.18,26.35 63.18,28.26 64.14,29.21 CN2.P$90
NC@4
  Bottom 0.178: CN1.P$95 60.01,2.86 60.01,6.67 59.37,7.3 59.37,9.21 60.33,10.16 CN2.P$95
NC@5
  Top 0.178: CN1.P$100 57.47,7.94 57.47,23.18 56.83,23.81 56.83,25.72 57.78,26.67 CN2.P$100
NC@6
  Bottom 0.178: CN1.P$107 52.39,2.86 52.39,6.67 51.75,7.3 51.75,9.21 52.7,10.16 CN2.P$107
NC@7
  Top 0.178: CN1.P$108 52.39,7.94 52.39,23.18 51.75,23.81 51.75,25.72 52.7,26.67 CN2.P$108
NC@8
  Top 0.178: CN1.P$109 51.12,5.4 51.12,9.21 50.48,9.84 50.48,23.18 51.12,23.81 51.12,26.35 CN2.P$109
NC@9
  Bottom 0.178: CN1.P$110 51.12,10.48 51.12,25.72 50.48,26.35 50.48,28.26 51.44,29.21 CN2.P$110
NC@10
  Bottom 0.178: CN1.P$115 47.31,2.86 47.31,6.67 46.67,7.3 46.67,9.21 47.62,10.16 CN2.P$115
NC@11
  Top 0.178: CN1.P$116 47.31,7.3 47.31,4.76 46.67,4.13 44.77,4.13 44.77,6.67 44.13,7.3 44.13,9.21 44.77,9.84 44.77,23.18 42.86,25.08 42.86,28.26 44.77,30.16 47.62,30.16 CN2.P$116
NC@12
  Bottom 0.178: CN1.P$134 35.88,10.48 35.88,25.72 35.24,26.35 35.24,28.26 36.2,29.21 CN2.P$134
PIXELCLK
  Bottom 0.178: CN1.P$154 23.81,10.48 23.81,25.72 24.45,26.35 24.45,28.26 23.5,29.21 CN2.P$154
R_W
  Top 0.178: CN1.P$93 61.28,5.4 61.28,9.21 60.64,9.84 60.64,23.18 61.28,23.81 61.28,26.35 CN2.P$93
RIGHT
  Bottom 0.178: CN1.P$182 4.76,11.11 4.76,26.99 5.71,27.94 CN2.P$182
RIGHT_EXT
  Top 0.178: CN1.P$181 5.08,5.71 5.08,9.53 4.76,9.84 4.76,25.72 CN2.P$181
SIZ0
  Top 0.178: 65.09,7.94 CN1.P$88 | 65.09,23.18 64.45,23.81 64.45,25.72 65.41,26.67 CN2.P$88
  Top 0.203: 65.09,23.18 65.09,7.94
SIZ1
  Bottom 0.178: CN1.P$87 65.09,2.86 65.09,6.67 64.45,7.3 64.45,9.21 65.41,10.16
  Bottom 0.203: CN2.P$87 65.41,10.16
VCC@1
  Bottom 0.178: CN1.P$10 117.79,10.48 117.79,25.72 118.43,26.35 118.43,28.26 117.47,29.21 CN2.P$10
VCC@2
  Top 0.178: CN1.P$20 110.81,7.94 110.81,23.18 110.17,23.81 110.17,25.72 111.12,26.67 CN2.P$20
VCC@3
  Bottom 0.178: CN1.P$30 105.09,10.48 105.09,25.72 105.73,26.35 105.73,28.26 104.78,29.21 CN2.P$30
VCC@4
  Top 0.178: CN1.P$40 98.11,7.94 98.11,23.18 97.47,23.81 97.47,25.72 98.42,26.67 CN2.P$40
VCC@5
  Bottom 0.178: CN1.P$50 91.76,10.48 91.76,25.72 91.12,26.35 91.12,28.26 92.08,29.21 CN2.P$50
VCC@6
  Top 0.178: CN1.P$60 85.41,7.94 85.41,23.18 84.77,23.81 84.77,25.72 85.72,26.67 CN2.P$60
VCC@7
  Bottom 0.178: CN1.P$70 79.06,10.48 79.06,25.72 78.42,26.35 78.42,28.26 79.38,29.21 CN2.P$70
VCC@8
  Top 0.178: CN1.P$80 72.71,7.94 72.71,23.18 72.07,23.81 72.07,25.72 73.03,26.67 CN2.P$80
VCC@9
  Bottom 0.178: CN1.P$102 56.2,10.48 56.2,25.72 55.56,26.35 55.56,28.26 56.52,29.21 CN2.P$102
VCC@11
  Bottom 0.178: CN1.P$146 28.26,10.48 28.26,25.72 27.62,26.35 27.62,28.26 28.57,29.21 CN2.P$146
VCC@12
  Top 0.178: CN1.P$156 22.54,7.94 22.54,23.18 23.18,23.81 23.18,25.72 22.23,26.67 CN2.P$156
VCC@13
  Bottom 0.178: CN1.P$176 9.84,7.94 9.84,23.18 10.48,23.81 10.48,25.72 9.53,26.67 CN2.P$176
VGND@1
  Top 0.178: CN1.P$161 18.1,5.4 18.1,9.21 17.46,9.84 17.46,23.18 18.1,23.81 18.1,26.35 CN2.P$161
VGND@2
  Bottom 0.178: CN1.P$162 18.1,10.48 18.1,25.72 17.46,26.35 17.46,28.26 18.41,29.21 CN2.P$162
VGND@3
  Top 0.178: CN1.P$169 13.02,5.4 13.02,9.21 12.38,9.84 12.38,23.18 13.34,24.13 CN2.P$169
VGND@4
  Bottom 0.178: CN1.P$170 13.02,10.48 13.02,25.72 12.38,26.35 12.38,28.26 13.34,29.21 CN2.P$170
XCLK
  Top 0.178: CN1.P$173 10.48,5.4 10.48,9.21 9.84,9.84 9.84,23.18 10.48,23.81 10.48,26.35 CN2.P$173